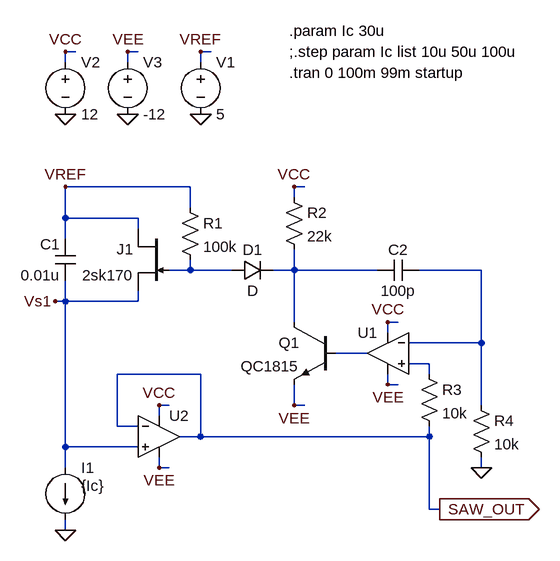
[diagram p0: schematic VCO_Sawtooth.asc]
VCO_Sawtooth.asc, the LTspice schematic file:
Version 4
SHEET 1 1200 680
WIRE -144 -320 -160 -320
WIRE -48 -320 -64 -320
WIRE 64 -320 48 -320
WIRE -160 -304 -160 -320
WIRE -64 -304 -64 -320
WIRE 48 -304 48 -320
WIRE 32 -112 -160 -112
WIRE 208 -112 192 -112
WIRE 192 -96 192 -112
WIRE 32 -80 32 -112
WIRE -160 -64 -160 -112
WIRE -48 -64 -160 -64
WIRE -48 -48 -48 -64
WIRE -160 -32 -160 -64
WIRE 32 16 32 0
WIRE 32 16 0 16
WIRE 96 16 32 16
WIRE 192 16 192 -16
WIRE 192 16 160 16
WIRE 320 16 192 16
WIRE 480 16 384 16
WIRE -160 64 -160 32
WIRE -160 64 -176 64
WIRE -48 64 -48 48
WIRE -48 64 -160 64
WIRE 192 96 192 16
WIRE 352 96 336 96
WIRE 336 112 336 96
WIRE 480 128 480 16
WIRE 480 128 368 128
WIRE 304 144 256 144
WIRE 400 160 368 160
WIRE 48 176 -80 176
WIRE 400 176 400 160
WIRE 336 192 336 176
WIRE 352 192 336 192
WIRE 0 224 -16 224
WIRE 192 224 192 192
WIRE 208 224 192 224
WIRE 480 224 480 128
WIRE -16 240 -16 224
WIRE -80 256 -80 176
WIRE -48 256 -80 256
WIRE 48 272 48 176
WIRE 48 272 16 272
WIRE 400 272 400 256
WIRE 400 272 48 272
WIRE -160 288 -160 64
WIRE -48 288 -160 288
WIRE -160 320 -160 288
WIRE -16 320 -16 304
WIRE 0 320 -16 320
WIRE 480 320 480 304
WIRE 400 384 400 272
WIRE 416 384 400 384
WIRE -160 416 -160 400
FLAG -160 -224 0
FLAG -64 -224 0
FLAG -160 -320 VCC
FLAG -64 -320 VEE
FLAG 336 96 VCC
FLAG 336 192 VEE
FLAG 192 -112 VCC
FLAG 192 224 VEE
FLAG 480 320 0
FLAG -16 224 VCC
FLAG -16 320 VEE
FLAG -160 416 0
FLAG -160 -112 VREF
FLAG 48 -224 0
FLAG 48 -320 VREF
FLAG 416 384 SAW_OUT
IOPIN 416 384 Out
FLAG -176 64 Vs1
SYMBOL voltage -160 -320 R0
WINDOW 123 0 0 Left 2
WINDOW 39 0 0 Left 2
SYMATTR InstName V2
SYMATTR Value 12
SYMBOL voltage -64 -320 R0
WINDOW 123 0 0 Left 2
WINDOW 39 0 0 Left 2
SYMATTR InstName V3
SYMATTR Value -12
SYMBOL cap -144 -32 M0
SYMATTR InstName C1
SYMATTR Value 0.01u
SYMBOL njf 0 -48 M0
SYMATTR InstName J1
SYMATTR Value 2sk170
SYMBOL res 16 -96 R0
SYMATTR InstName R1
SYMATTR Value 100k
SYMBOL Opamps\\UniversalOpamp2 336 144 M0
SYMATTR InstName U1
SYMBOL npn 256 96 M0
SYMATTR InstName Q1
SYMATTR Value QC1815
SYMBOL diode 96 32 R270
WINDOW 0 32 32 VTop 2
WINDOW 3 0 32 VBottom 2
SYMATTR InstName D1
SYMBOL res 176 -112 R0
SYMATTR InstName R2
SYMATTR Value 22k
SYMBOL cap 384 0 R90
WINDOW 0 0 32 VBottom 2
WINDOW 3 32 32 VTop 2
SYMATTR InstName C2
SYMATTR Value 100p
SYMBOL res 384 160 R0
SYMATTR InstName R3
SYMATTR Value 10k
SYMBOL res 464 208 R0
SYMATTR InstName R4
SYMATTR Value 10k
SYMBOL Opamps\\UniversalOpamp2 -16 272 R0
SYMATTR InstName U2
SYMBOL current -160 320 R0
WINDOW 3 24 28 Left 2
WINDOW 123 0 0 Left 2
WINDOW 39 0 0 Left 2
SYMATTR Value {Ic}
SYMATTR InstName I1
SYMBOL voltage 48 -320 R0
WINDOW 123 0 0 Left 2
WINDOW 39 0 0 Left 2
SYMATTR InstName V1
SYMATTR Value 5
TEXT 184 -320 Left 2 !;.step param Ic list 10u 50u 100u
TEXT 184 -288 Left 2 !.tran 0 100m 99m startup
TEXT 184 -352 Left 2 !.param Ic 30u

The netlist it stands for:
* VCO_Sawtooth.asc
V2 VCC 0 12
V3 VEE 0 -12
C1 VREF Vs1 0.01u
J1 VREF N001 Vs1 2sk170
R1 VREF N001 100k
XU1 N005 N003 VCC VEE N004 level.2 Avol=1Meg GBW=10Meg Slew=10Meg ilimit=25m rail=0 Vos=0 phimargin=45 en=0 enk=0 in=0 ink=0 Rin=500Meg  ; pins IN+ IN- V+ V- OUT
Q1 N002 N004 VEE 0 QC1815
D1 N001 N002 D
R2 VCC N002 22k
C2 N003 N002 100p
R3 N005 SAW_OUT 10k
R4 N003 0 10k
XU2 Vs1 SAW_OUT VCC VEE SAW_OUT level.2 Avol=1Meg GBW=10Meg Slew=10Meg ilimit=25m rail=0 Vos=0 phimargin=45 en=0 enk=0 in=0 ink=0 Rin=500Meg  ; pins IN+ IN- V+ V- OUT
I1 Vs1 0 {Ic}
V1 VREF 0 5
.model D D
.lib standard.dio
.model NPN NPN
.model PNP PNP
.lib standard.bjt
.model NJF NJF
.model PJF PJF
.lib standard.jft
;.step param Ic list 10u 50u 100u
.tran 0 100m 99m startup
.param Ic 30u
.lib UniversalOpamps2.sub
.backanno
.end